# Altium schematic sheet TUDSSL_condenar__Hardware_PCBs_Misc_Apo4devkit2COM50_Schematic1__3_Probing.schdoc
size 309 x 223 mm; Symbol: Sheet-Symbol_A4; Device: Sheet-Symbol_A4; Company: EasyEDA.com; Drawed: EasyEDA Pro; Reviewed: EasyEDA Pro; Version: V0.1; Page Size: A4; @Project Name: TUD-EnergyHarvestingConsole_2022-08-29_17-01-09; @Page Count: 4; @Update Date: 2022-11-22; @Create Date: 2022-11-20; @Schematic Name: Schematic1; Part Number: JLCPCB-002; @Page No: 4; @Page Name: Probing
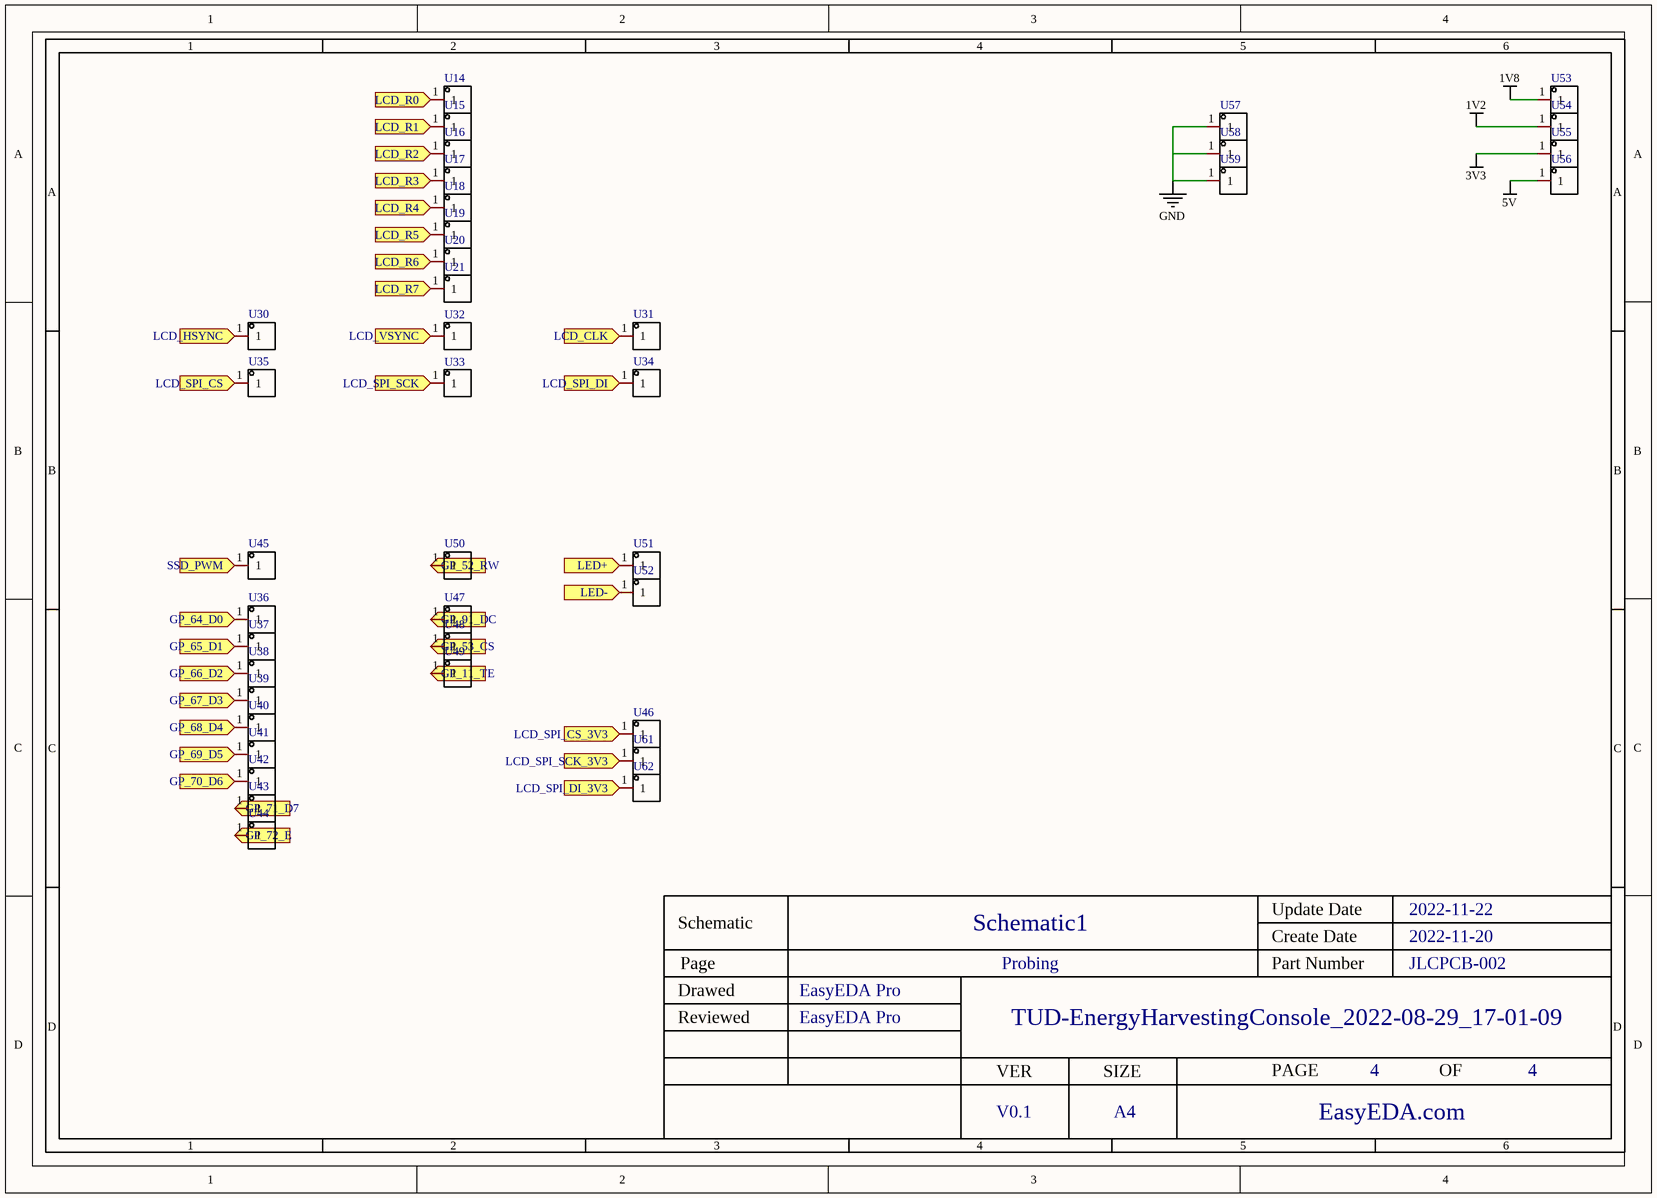
[diagram p0: TUDSSL_condenar__Hardware_PCBs_Misc_Apo4devkit2COM50_Schematic1__3_Probing.schdoc]

## Parts
U14  5001_C238122  [TEST-TH_BD2.54-P1.39]  (value not drawn)
U15  5001_C238122  [TEST-TH_BD2.54-P1.39]  (value not drawn)
U16  5001_C238122  [TEST-TH_BD2.54-P1.39]  (value not drawn)
U17  5001_C238122  [TEST-TH_BD2.54-P1.39]  (value not drawn)
U18  5001_C238122  [TEST-TH_BD2.54-P1.39]  (value not drawn)
U19  5001_C238122  [TEST-TH_BD2.54-P1.39]  (value not drawn)
U20  5001_C238122  [TEST-TH_BD2.54-P1.39]  (value not drawn)
U21  5001_C238122  [TEST-TH_BD2.54-P1.39]  (value not drawn)
U30  5001_C238122  [TEST-TH_BD2.54-P1.39]  (value not drawn)
U31  5001_C238122  [TEST-TH_BD2.54-P1.39]  (value not drawn)
U32  5001_C238122  [TEST-TH_BD2.54-P1.39]  (value not drawn)
U33  5001_C238122  [TEST-TH_BD2.54-P1.39]  (value not drawn)
U34  5001_C238122  [TEST-TH_BD2.54-P1.39]  (value not drawn)
U35  5001_C238122  [TEST-TH_BD2.54-P1.39]  (value not drawn)
U36  5001_C238122  [TEST-TH_BD2.54-P1.39]  (value not drawn)
U37  5001_C238122  [TEST-TH_BD2.54-P1.39]  (value not drawn)
U38  5001_C238122  [TEST-TH_BD2.54-P1.39]  (value not drawn)
U39  5001_C238122  [TEST-TH_BD2.54-P1.39]  (value not drawn)
U40  5001_C238122  [TEST-TH_BD2.54-P1.39]  (value not drawn)
U41  5001_C238122  [TEST-TH_BD2.54-P1.39]  (value not drawn)
U42  5001_C238122  [TEST-TH_BD2.54-P1.39]  (value not drawn)
U43  5001_C238122  [TEST-TH_BD2.54-P1.39]  (value not drawn)
U44  5001_C238122  [TEST-TH_BD2.54-P1.39]  (value not drawn)
U45  5001_C238122  [TEST-TH_BD2.54-P1.39]  (value not drawn)
U46  5001_C238122  [TEST-TH_BD2.54-P1.39]  (value not drawn)
U47  5001_C238122  [TEST-TH_BD2.54-P1.39]  (value not drawn)
U48  5001_C238122  [TEST-TH_BD2.54-P1.39]  (value not drawn)
U49  5001_C238122  [TEST-TH_BD2.54-P1.39]  (value not drawn)
U50  5001_C238122  [TEST-TH_BD2.54-P1.39]  (value not drawn)
U51  5001_C238122  [TEST-TH_BD2.54-P1.39]  (value not drawn)
U52  5001_C238122  [TEST-TH_BD2.54-P1.39]  (value not drawn)
U53  5001_C238122  [TEST-TH_BD2.54-P1.39]  (value not drawn)
U54  5001_C238122  [TEST-TH_BD2.54-P1.39]  (value not drawn)
U55  5001_C238122  [TEST-TH_BD2.54-P1.39]  (value not drawn)
U56  5001_C238122  [TEST-TH_BD2.54-P1.39]  (value not drawn)
U57  5001_C238122  [TEST-TH_BD2.54-P1.39]  (value not drawn)
U58  5001_C238122  [TEST-TH_BD2.54-P1.39]  (value not drawn)
U59  5001_C238122  [TEST-TH_BD2.54-P1.39]  (value not drawn)
U61  5001_C238122  [TEST-TH_BD2.54-P1.39]  (value not drawn)
U62  5001_C238122  [TEST-TH_BD2.54-P1.39]  (value not drawn)

## Ports
GP_11_TE (in), GP_52_RW (in), GP_53_CS (in), GP_64_D0 (in), GP_65_D1 (in), GP_66_D2 (in), GP_67_D3 (in), GP_68_D4 (in), GP_69_D5 (in), GP_70_D6 (in), GP_71_D7 (in), GP_72_E (in), GP_91_DC (in), LCD_CLK (in), LCD_HSYNC (in), LCD_R0 (in), LCD_R1 (in), LCD_R2 (in), LCD_R3 (in), LCD_R4 (in), LCD_R5 (in), LCD_R6 (in), LCD_R7 (in), LCD_SPI_CS (in), LCD_SPI_CS_3V3 (in), LCD_SPI_DI (in), LCD_SPI_DI_3V3 (in), LCD_SPI_SCK (in), LCD_SPI_SCK_3V3 (in), LCD_VSYNC (in), LED+ (in), LED- (in), SSD_PWM (in)

## Nets
1V2: U54.1
1V8: U53.1
3V3: U55.1
5V: U56.1
GND: U57.1 U58.1 U59.1
GP_11_TE: U49.1 ; port GP_11_TE
GP_52_RW: U50.1 ; port GP_52_RW
GP_53_CS: U48.1 ; port GP_53_CS
GP_64_D0: U36.1 ; port GP_64_D0
GP_65_D1: U37.1 ; port GP_65_D1
GP_66_D2: U38.1 ; port GP_66_D2
GP_67_D3: U39.1 ; port GP_67_D3
GP_68_D4: U40.1 ; port GP_68_D4
GP_69_D5: U41.1 ; port GP_69_D5
GP_70_D6: U42.1 ; port GP_70_D6
GP_71_D7: U43.1 ; port GP_71_D7
GP_72_E: U44.1 ; port GP_72_E
GP_91_DC: U47.1 ; port GP_91_DC
LCD_CLK: U31.1 ; port LCD_CLK
LCD_HSYNC: U30.1 ; port LCD_HSYNC
LCD_R0: U14.1 ; port LCD_R0
LCD_R1: U15.1 ; port LCD_R1
LCD_R2: U16.1 ; port LCD_R2
LCD_R3: U17.1 ; port LCD_R3
LCD_R4: U18.1 ; port LCD_R4
LCD_R5: U19.1 ; port LCD_R5
LCD_R6: U20.1 ; port LCD_R6
LCD_R7: U21.1 ; port LCD_R7
LCD_SPI_CS: U35.1 ; port LCD_SPI_CS
LCD_SPI_CS_3V3: U46.1 ; port LCD_SPI_CS_3V3
LCD_SPI_DI: U34.1 ; port LCD_SPI_DI
LCD_SPI_DI_3V3: U62.1 ; port LCD_SPI_DI_3V3
LCD_SPI_SCK: U33.1 ; port LCD_SPI_SCK
LCD_SPI_SCK_3V3: U61.1 ; port LCD_SPI_SCK_3V3
LCD_VSYNC: U32.1 ; port LCD_VSYNC
LED+: U51.1 ; port LED+
LED-: U52.1 ; port LED-
SSD_PWM: U45.1 ; port SSD_PWM

## Notes on the sheet
- 1
- 2
- 3
- 4
- 5
- 6
- A
- B
- C
- Schematic
- Schematic1
- Create Date
- Update Date
- 2022-11-22
- 2022-11-20
- Reviewed
- Drawed
- Page
- EasyEDA Pro
- Probing
- Part Number
- TUD-EnergyHarvestingConsole_2022-08-29_17-01-09
- JLCPCB-002
- D
- VER
- SIZE
- PAGE
- OF
- V0.1
- A4
- EasyEDA.com

## Library data of the parts
U14-U21 U30-U59 U61 U62 = 5001_C238122: Manufacturer: Keystone; Name: 5001; Add into BOM: yes; Symbol: 5001; Device: 5001_C238122; LCSC Part Name: 5001; Supplier Part: C238122; Manufacturer Part: 5001; Supplier Footprint: -; JLCPCB Part Class: Extended Part; Datasheet: https://atta.szlcsc.com/upload/public/pdf/source/20180629/C238122_5414CA0820D317C81C4E2A76836F6CFC.PDF; Supplier: LCSC; Convert to PCB: yes